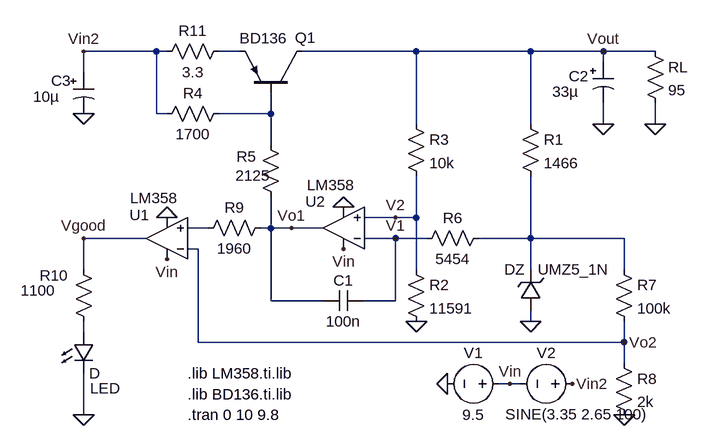
[diagram p0: schematic lab2temp.asc]
lab2temp.asc, the LTspice schematic file:
Version 4
SHEET 1 880 680
WIRE 48 48 -64 48
WIRE 64 48 48 48
WIRE 176 48 144 48
WIRE 448 48 272 48
WIRE 624 48 448 48
WIRE 736 48 624 48
WIRE 816 48 736 48
WIRE 736 64 736 48
WIRE -64 80 -64 48
WIRE 48 144 48 48
WIRE 64 144 48 144
WIRE 224 144 224 112
WIRE 224 144 144 144
WIRE 448 160 448 48
WIRE 624 160 624 48
WIRE 736 160 736 128
WIRE 816 160 816 128
WIRE 224 192 224 144
WIRE 416 304 368 304
WIRE 448 304 448 240
WIRE 448 304 416 304
WIRE 128 320 96 320
WIRE 224 320 224 272
WIRE 224 320 208 320
WIRE 256 320 224 320
WIRE 304 320 256 320
WIRE 32 336 -64 336
WIRE 416 336 368 336
WIRE 464 336 416 336
WIRE 624 336 624 240
WIRE 624 336 544 336
WIRE 768 336 624 336
WIRE 112 352 96 352
WIRE -64 384 -64 336
WIRE 448 384 448 304
WIRE 624 384 624 336
WIRE 768 384 768 336
WIRE 224 432 224 320
WIRE 304 432 224 432
WIRE 416 432 416 336
WIRE 416 432 368 432
WIRE 624 464 624 448
WIRE -64 480 -64 464
WIRE 112 496 112 352
WIRE 768 496 768 464
WIRE 768 496 112 496
WIRE 768 528 768 496
WIRE 592 560 576 560
WIRE 608 560 592 560
WIRE -64 608 -64 544
FLAG 624 464 0
FLAG 448 464 0
FLAG 816 160 0
FLAG 736 160 0
FLAG -64 144 0
FLAG -64 608 0
FLAG 768 608 0
FLAG -64 336 Vgood
FLAG 768 496 Vo2
FLAG 256 320 Vo1
FLAG 336 352 Vin
FLAG 64 368 Vin
FLAG 64 304 0
FLAG 336 288 0
FLAG -64 48 Vin2
FLAG 496 560 0
FLAG 688 560 Vin2
FLAG 416 336 V1
FLAG 416 304 V2
FLAG 736 48 Vout
FLAG 592 560 Vin
SYMBOL polcap -80 80 R0
WINDOW 0 -34 13 Left 2
WINDOW 3 -62 38 Left 2
SYMATTR InstName C3
SYMATTR Value 10µ
SYMATTR Description Capacitor
SYMATTR Type cap
SYMBOL res 160 32 R90
WINDOW 0 0 56 VBottom 2
WINDOW 3 32 56 VTop 2
SYMATTR InstName R11
SYMATTR Value 3.3
SYMBOL res 160 128 R90
WINDOW 0 0 56 VBottom 2
WINDOW 3 32 56 VTop 2
SYMATTR InstName R4
SYMATTR Value 1700
SYMBOL pnp 272 112 M270
WINDOW 0 85 11 VLeft 2
WINDOW 3 84 96 VLeft 2
SYMATTR InstName Q1
SYMATTR Value BD136
SYMBOL res 208 176 R0
WINDOW 0 -37 34 Left 2
WINDOW 3 -38 63 Left 2
SYMATTR InstName R5
SYMATTR Value 2125
SYMBOL OpAmps\\opamp2 64 400 R180
WINDOW 0 27 100 Left 2
WINDOW 3 -18 126 Left 2
SYMATTR InstName U1
SYMATTR Value LM358
SYMBOL cap 368 416 R90
WINDOW 0 0 32 VBottom 2
WINDOW 3 32 32 VTop 2
SYMATTR InstName C1
SYMATTR Value 100n
SYMBOL OpAmps\\opamp2 336 384 R180
WINDOW 0 28 105 Left 2
WINDOW 3 -18 130 Left 2
SYMATTR InstName U2
SYMATTR Value LM358
SYMBOL res 560 320 R90
WINDOW 0 0 56 VBottom 2
WINDOW 3 32 56 VTop 2
SYMATTR InstName R6
SYMATTR Value 5454
SYMBOL zener 640 448 R180
WINDOW 0 24 64 Left 2
WINDOW 3 -105 64 Left 2
SYMATTR InstName DZ
SYMATTR Value UMZ5_1N
SYMBOL res 432 368 R0
SYMATTR InstName R2
SYMATTR Value 11591
SYMBOL res 432 144 R0
SYMATTR InstName R3
SYMATTR Value 10k
SYMBOL res 608 144 R0
SYMATTR InstName R1
SYMATTR Value 1466
SYMBOL res 800 32 R0
SYMATTR InstName RL
SYMATTR Value 95
SYMBOL polcap 720 64 R0
WINDOW 0 -37 22 Left 2
WINDOW 3 -63 46 Left 2
SYMATTR InstName C2
SYMATTR Value 33µ
SYMATTR Description Capacitor
SYMATTR Type cap
SYMATTR SpiceLine V=100 Irms=140m Rser=0.13 Lser=8n mfg="Würth Elektronik" pn="860130875008 WCAP-ATET 10x16" type="Al electrolytic"
SYMBOL res 752 368 R0
SYMATTR InstName R7
SYMATTR Value 100k
SYMBOL res 752 512 R0
SYMATTR InstName R8
SYMATTR Value 2k
SYMBOL res -80 368 R0
WINDOW 0 -52 25 Left 2
WINDOW 3 -81 48 Left 2
SYMATTR InstName R10
SYMATTR Value 1100
SYMBOL LED -80 480 R0
WINDOW 0 26 87 Left 2
SYMATTR InstName LED
SYMBOL res 224 304 R90
WINDOW 0 0 56 VBottom 2
WINDOW 3 32 56 VTop 2
SYMATTR InstName R9
SYMATTR Value 1960
SYMBOL voltage 592 560 R90
WINDOW 0 -32 56 VBottom 2
WINDOW 3 32 56 VTop 2
WINDOW 123 0 0 Left 0
WINDOW 39 0 0 Left 0
SYMATTR InstName V1
SYMATTR Value 9.5
SYMBOL voltage 704 560 R90
WINDOW 0 -32 56 VBottom 2
WINDOW 3 31 9 VTop 2
WINDOW 123 0 0 Left 0
WINDOW 39 0 0 Left 0
SYMATTR InstName V2
SYMATTR Value SINE(3.35 2.65 100)
TEXT 96 544 Left 2 !.lib LM358.ti.lib
TEXT 96 576 Left 2 !.lib BD136.ti.lib
TEXT 96 608 Left 2 !.tran 0 10 9.8

The netlist it stands for:
* lab2temp.asc
C3 Vin2 0 10µ
R11 N001 Vin2 3.3
R4 N002 Vin2 1700
Q1 Vout N002 N001 0 BD136
R5 N002 Vo1 2125
XU1 N003 Vo2 Vin 0 Vgood LM358  ; pins In+ In- V+ V- OUT
C1 V1 Vo1 100n
XU2 V2 V1 Vin 0 Vo1 LM358  ; pins In+ In- V+ V- OUT
R6 N004 V1 5454
DZ 0 N004 UMZ5_1N
R2 V2 0 11591
R3 Vout V2 10k
R1 Vout N004 1466
RL Vout 0 95
C2 Vout 0 33µ V=100 Irms=140m Rser=0.13 Lser=8n mfg="Würth Elektronik" pn="860130875008 WCAP-ATET 10x16" type="Al electrolytic"
R7 N004 Vo2 100k
R8 Vo2 0 2k
R10 Vgood N005 1100
D§LED N005 0 D
R9 Vo1 N003 1960
V1 Vin 0 9.5
V2 Vin2 Vin SINE(3.35 2.65 100)
.model D D
.lib standard.dio
.model NPN NPN
.model PNP PNP
.lib standard.bjt
.lib LM358.ti.lib
.lib BD136.ti.lib
.tran 0 10 9.8
.backanno
.end